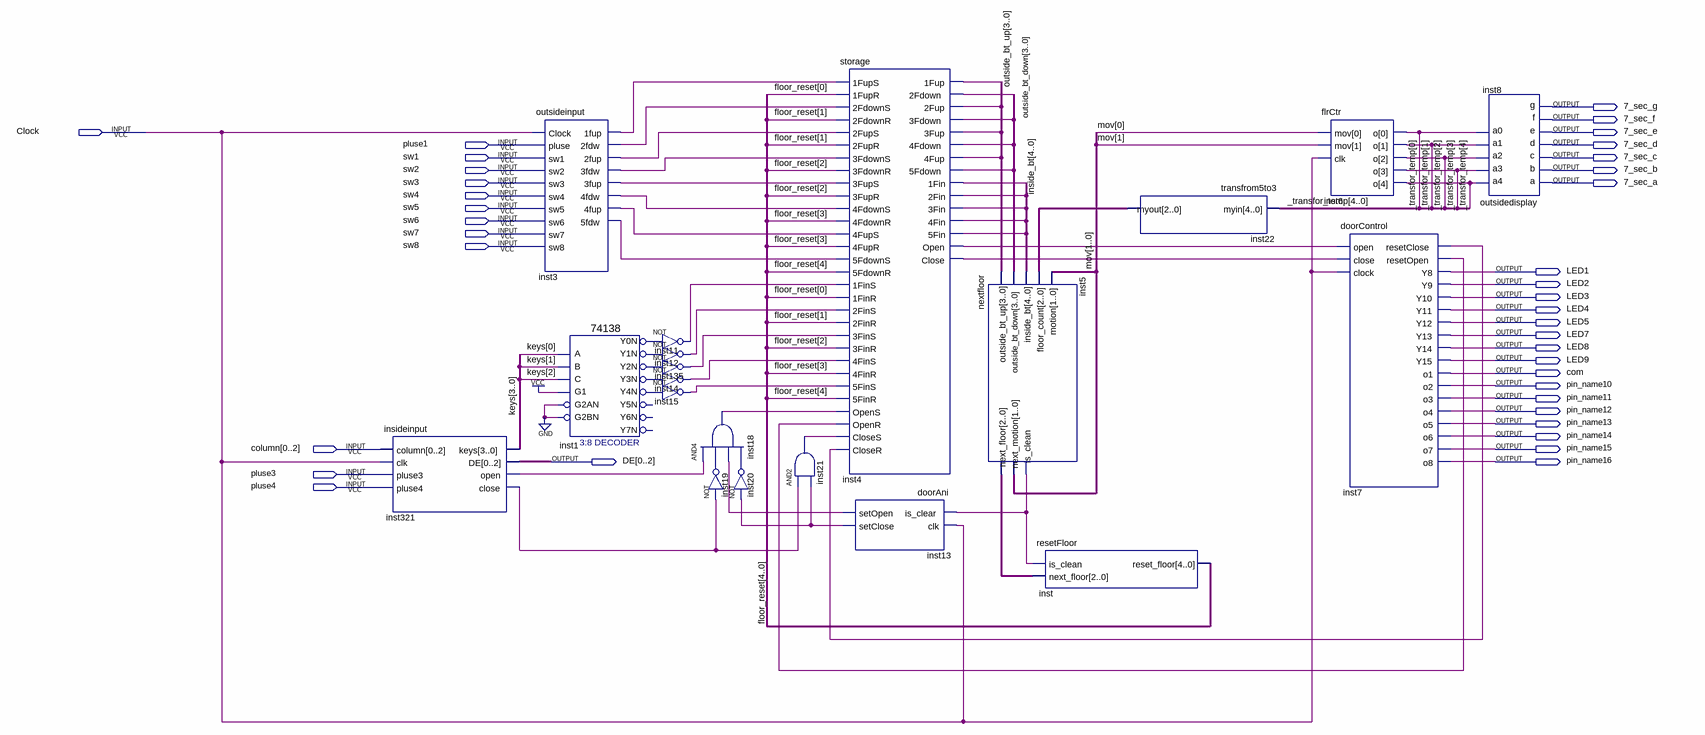
[diagram p0: schematic sheet]
// Quartus schematic myelevator.bdf as structural Verilog: 20 symbols, 37 pins
module myelevator (
  input  Clock,
  input  pluse1,
  input  sw1,
  input  sw2,
  input  sw3,
  input  sw4,
  input  sw5,
  input  sw6,
  input  sw7,
  input  sw8,
  input  [0:2] column,
  input  pluse3,
  input  pluse4,
  output \7_sec_g ,
  output \7_sec_f ,
  output \7_sec_e ,
  output \7_sec_d ,
  output \7_sec_c ,
  output \7_sec_b ,
  output \7_sec_a ,
  output LED1,
  output LED2,
  output LED3,
  output LED4,
  output LED5,
  output LED7,
  output LED8,
  output LED9,
  output com,
  output pin_name10,
  output pin_name11,
  output pin_name12,
  output pin_name13,
  output pin_name14,
  output pin_name15,
  output [0:2] DE,
  output pin_name16
);

  wire inst1_y0n, inst1_y1n, inst1_y2n, inst1_y3n, inst1_y4n, inst3_1fup, inst3_2fdw, inst3_2fup, inst3_3fdw,
       inst3_3fup, inst3_4fdw, inst3_4fup, inst3_5fdw, inst4_close, inst4_open, inst5_is_clean,
       inst7_resetclose, inst7_resetopen, inst11_out, inst12_out, inst13_setclose, inst13_setopen,
       inst14_out, inst15_out, inst18_out, inst19_out, inst20_out, inst21_out, inst135_out, inst321_close,
       inst321_open;
  wire [1:0] mov;
  wire [2:0] inst5_next_floor, inst22_myout;
  wire [3:0] keys, outside_bt_down, outside_bt_up;
  wire [4:0] _transfor_temp, floor_reset, inside_bt;

  insideinput inst321 (
    .column(column), .clk(Clock), .pluse3(pluse3), .pluse4(pluse4), .keys(keys), .DE(DE),
    .open(inst321_open), .close(inst321_close));
  outsideinput inst3 (
    .Clock(Clock), .pluse(pluse1), .sw1(sw1), .sw2(sw2), .sw3(sw3), .sw4(sw4), .sw5(sw5), .sw6(sw6),
    .sw7(sw7), .sw8(sw8), .\1fup (inst3_1fup), .\2fdw (inst3_2fdw), .\2fup (inst3_2fup), .\3fdw (inst3_3fdw),
    .\3fup (inst3_3fup), .\4fdw (inst3_4fdw), .\4fup (inst3_4fup), .\5fdw (inst3_5fdw));
  \74138  inst1 (
    .A(keys[0]), .B(keys[1]), .G1(1'b1), .C(keys[2]), .G2AN(1'b0), .G2BN(1'b0), .Y0N(inst1_y0n),
    .Y1N(inst1_y1n), .Y2N(inst1_y2n), .Y3N(inst1_y3n), .Y4N(inst1_y4n));  // open: Y5N, Y6N, Y7N
  not inst11 (inst11_out, inst1_y0n);
  not inst12 (inst12_out, inst1_y1n);
  not inst135 (inst135_out, inst1_y2n);
  not inst14 (inst14_out, inst1_y3n);
  not inst15 (inst15_out, inst1_y4n);
  and inst18 (inst18_out, inst321_open, inst19_out, inst13_setopen, inst20_out);
  not inst19 (inst19_out, inst321_close);
  not inst20 (inst20_out, inst13_setclose);
  and inst21 (inst21_out, inst321_close, inst13_setclose);
  storage inst4 (
    .\1FupS (inst3_1fup), .\1FupR (floor_reset[0]), .\2FdownS (inst3_2fdw), .\2FdownR (floor_reset[1]),
    .\2FupS (inst3_2fup), .\2FupR (floor_reset[1]), .\3FdownS (inst3_3fdw), .\3FdownR (floor_reset[2]),
    .\3FupS (inst3_3fup), .\3FupR (floor_reset[2]), .\4FdownS (inst3_4fdw), .\4FdownR (floor_reset[3]),
    .\4FupS (inst3_4fup), .\4FupR (floor_reset[3]), .\5FdownS (inst3_5fdw), .\5FdownR (floor_reset[4]),
    .\1FinS (inst11_out), .\1FinR (floor_reset[0]), .\2FinS (inst12_out), .\2FinR (floor_reset[1]),
    .\3FinS (inst135_out), .\3FinR (floor_reset[2]), .\4FinS (inst14_out), .\4FinR (floor_reset[3]),
    .\5FinS (inst15_out), .\5FinR (floor_reset[4]), .OpenS(inst18_out), .OpenR(inst7_resetopen),
    .CloseS(inst21_out), .CloseR(inst7_resetclose), .\1Fup (outside_bt_up[0]), .\2Fdown (outside_bt_down[0]),
    .\2Fup (outside_bt_up[1]), .\3Fdown (outside_bt_down[1]), .\3Fup (outside_bt_up[2]),
    .\4Fdown (outside_bt_down[2]), .\4Fup (outside_bt_up[3]), .\5Fdown (outside_bt_down[3]),
    .\1Fin (inside_bt[0]), .\2Fin (inside_bt[1]), .\3Fin (inside_bt[2]), .\4Fin (inside_bt[3]),
    .\5Fin (inside_bt[4]), .Open(inst4_open), .Close(inst4_close));
  doorAni inst13 (.is_clear(inst5_is_clean), .clk(Clock), .setOpen(inst13_setopen), .setClose(inst13_setclose));
  nextfloor inst5 (
    .outside_bt_up(outside_bt_up), .outside_bt_down(outside_bt_down), .inside_bt(inside_bt),
    .floor_count(inst22_myout), .motion(mov), .next_floor(inst5_next_floor), .next_motion(mov),
    .is_clean(inst5_is_clean));
  resetFloor inst (.is_clean(inst5_is_clean), .next_floor(inst5_next_floor), .reset_floor(floor_reset));
  transfrom5to3 inst22 (.myin(_transfor_temp), .myout(inst22_myout));
  flrCtr inst6 (.mov(mov), .clk(Clock), .o(_transfor_temp));
  doorControl inst7 (
    .open(inst4_open), .close(inst4_close), .clock(Clock), .resetClose(inst7_resetclose),
    .resetOpen(inst7_resetopen), .Y15(LED9), .Y12(LED5), .Y13(LED7), .Y9(LED2), .Y8(LED1), .Y10(LED3),
    .Y11(LED4), .Y14(LED8), .o1(com), .o2(pin_name10), .o3(pin_name11), .o4(pin_name12), .o5(pin_name13),
    .o6(pin_name14), .o7(pin_name15), .o8(pin_name16));
  outsidedisplay inst8 (
    .a4(_transfor_temp[4]), .a3(_transfor_temp[3]), .a2(_transfor_temp[2]), .a1(_transfor_temp[1]),
    .a0(_transfor_temp[0]), .a(\7_sec_a ), .b(\7_sec_b ), .c(\7_sec_c ), .d(\7_sec_d ), .e(\7_sec_e ),
    .f(\7_sec_f ), .g(\7_sec_g ));
endmodule
